# EAGLE design 国技館マトリクスLED (EAGLE 9.6.2)
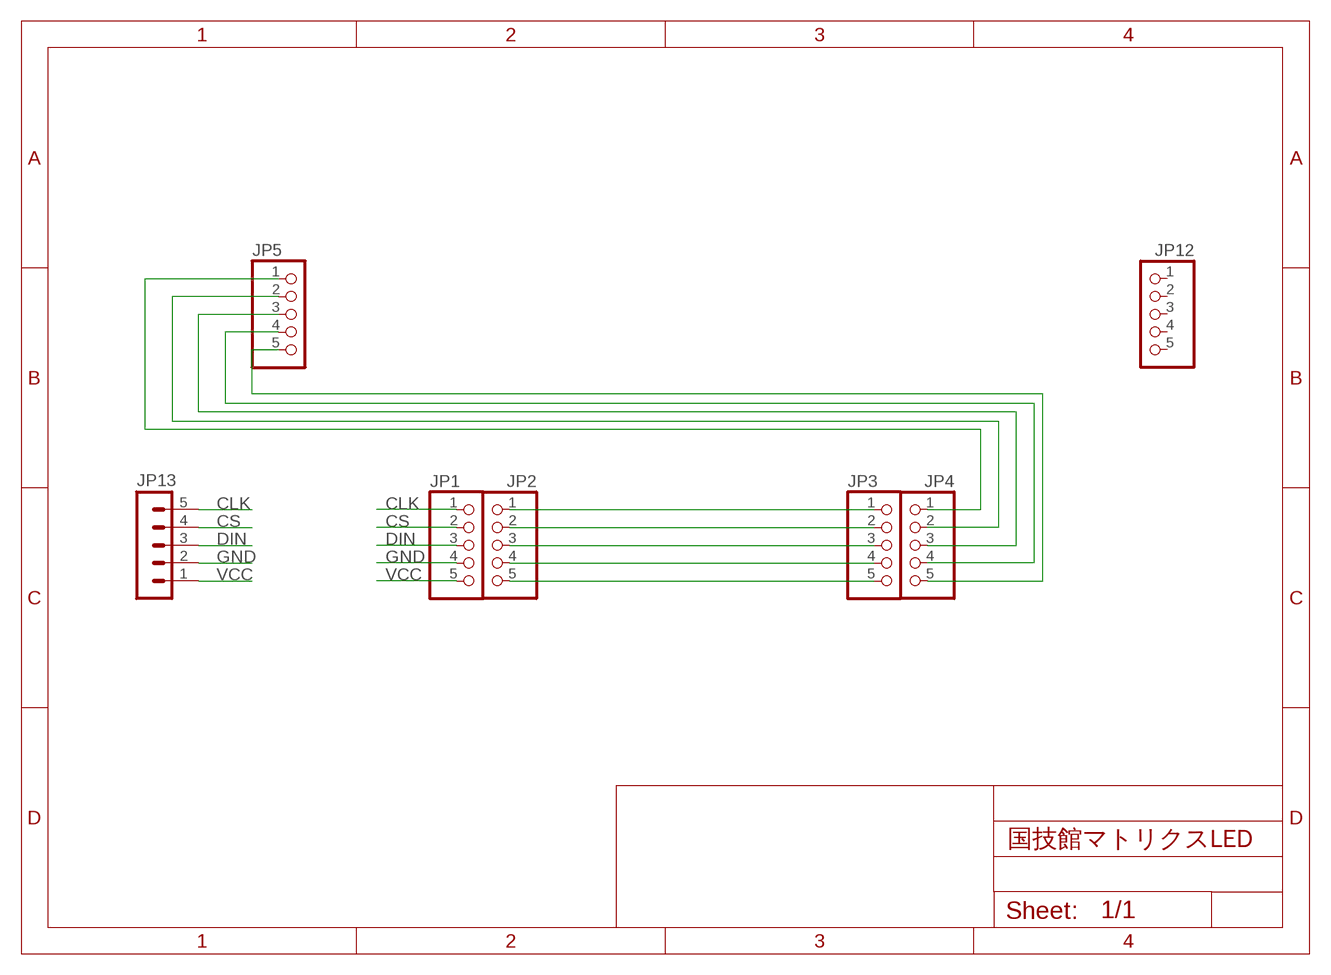
[diagram p0: schematic, sheet 1]

## Parts
JP1  PINHD-1X5  [1X05]
JP2  PINHD-1X5  [1X05]
JP3  PINHD-1X5  [1X05]
JP4  PINHD-1X5  [1X05]
JP5  PINHD-1X5  [1X05]
JP12  PINHD-1X5  [1X05]
JP13  05-JST  [B5B-XH]

## Nets
CLK: JP1.1 JP13.5
CS: JP1.2 JP13.4
DIN: JP1.3 JP13.3
GND: JP1.4 JP13.2
N$1: JP2.1 JP3.1
N$2: JP2.2 JP3.2
N$3: JP2.3 JP3.3
N$4: JP2.4 JP3.4
N$5: JP2.5 JP3.5
N$6: JP4.1 JP5.1
N$7: JP4.2 JP5.2
N$8: JP4.3 JP5.3
N$9: JP4.4 JP5.4
N$10: JP4.5 JP5.5
VCC: JP1.5 JP13.1
Unconnected: JP12.1 JP12.2 JP12.3 JP12.4 JP12.5

## Library data of the parts
JP1-JP5 JP12 = pinhead:PINHD-1X5: PIN HEADER
JP13 = con-jst-xh:05-JST: JST CONNECTOR

## Board
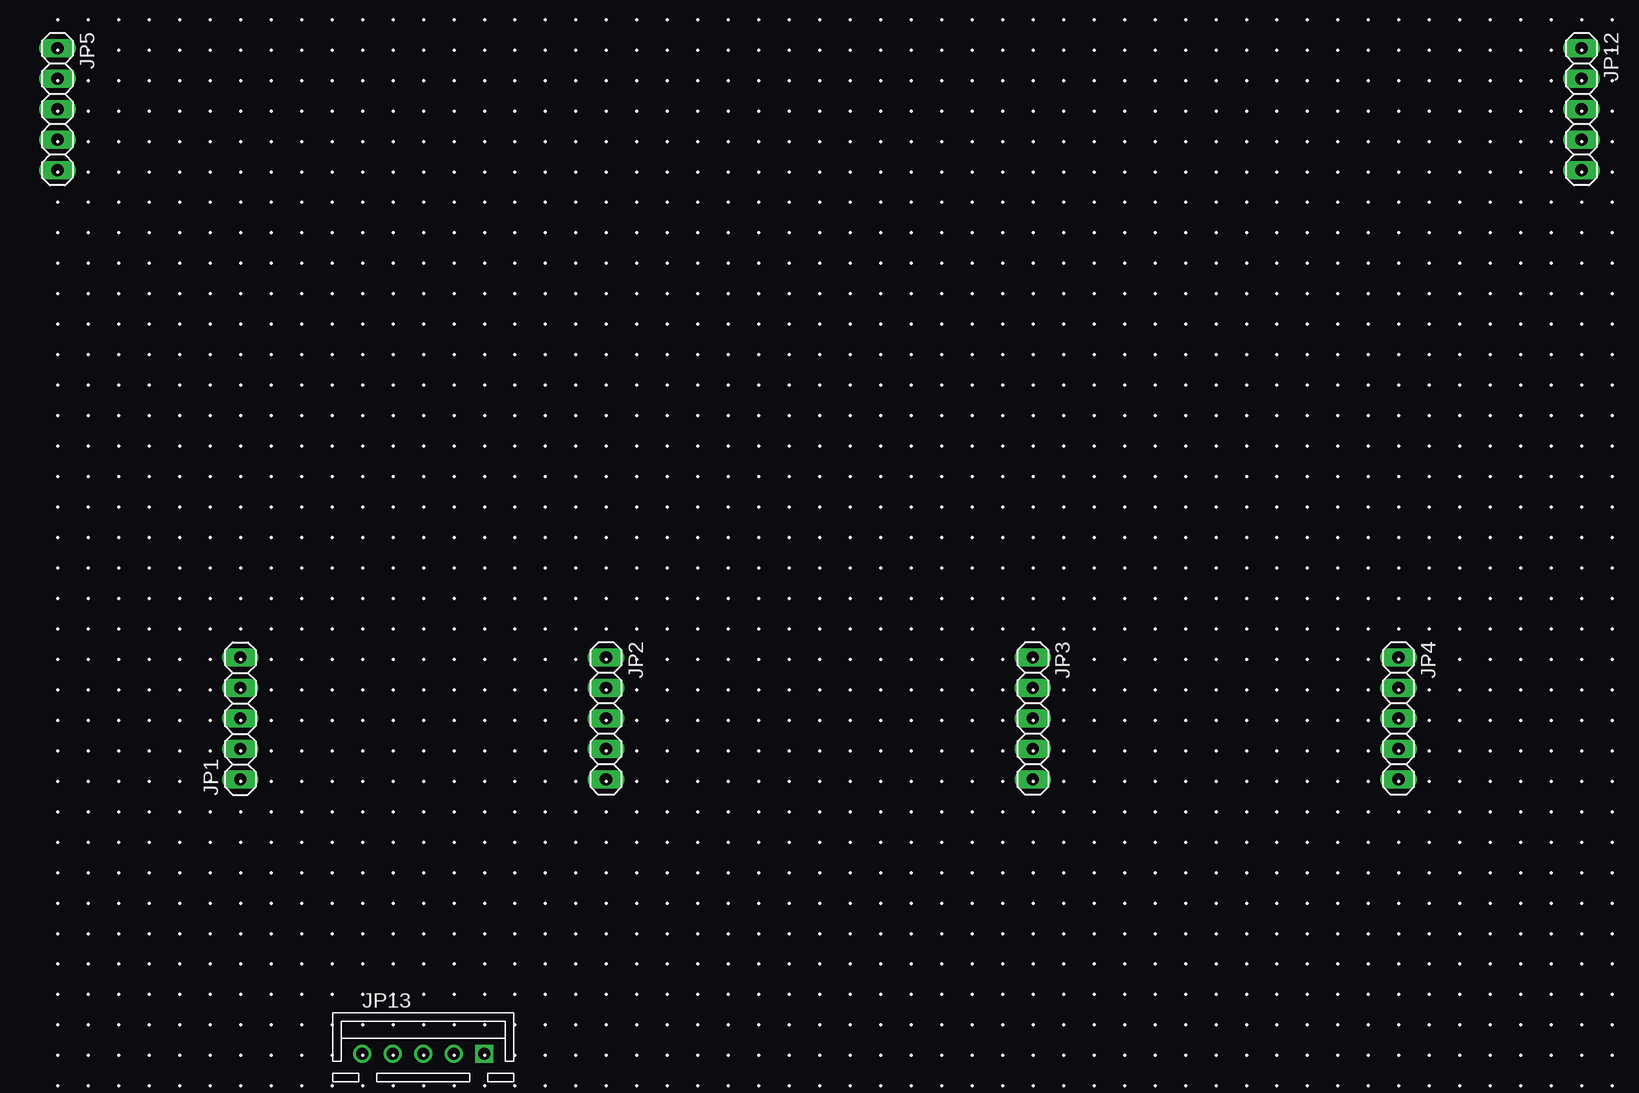
[diagram p1: board, top side]
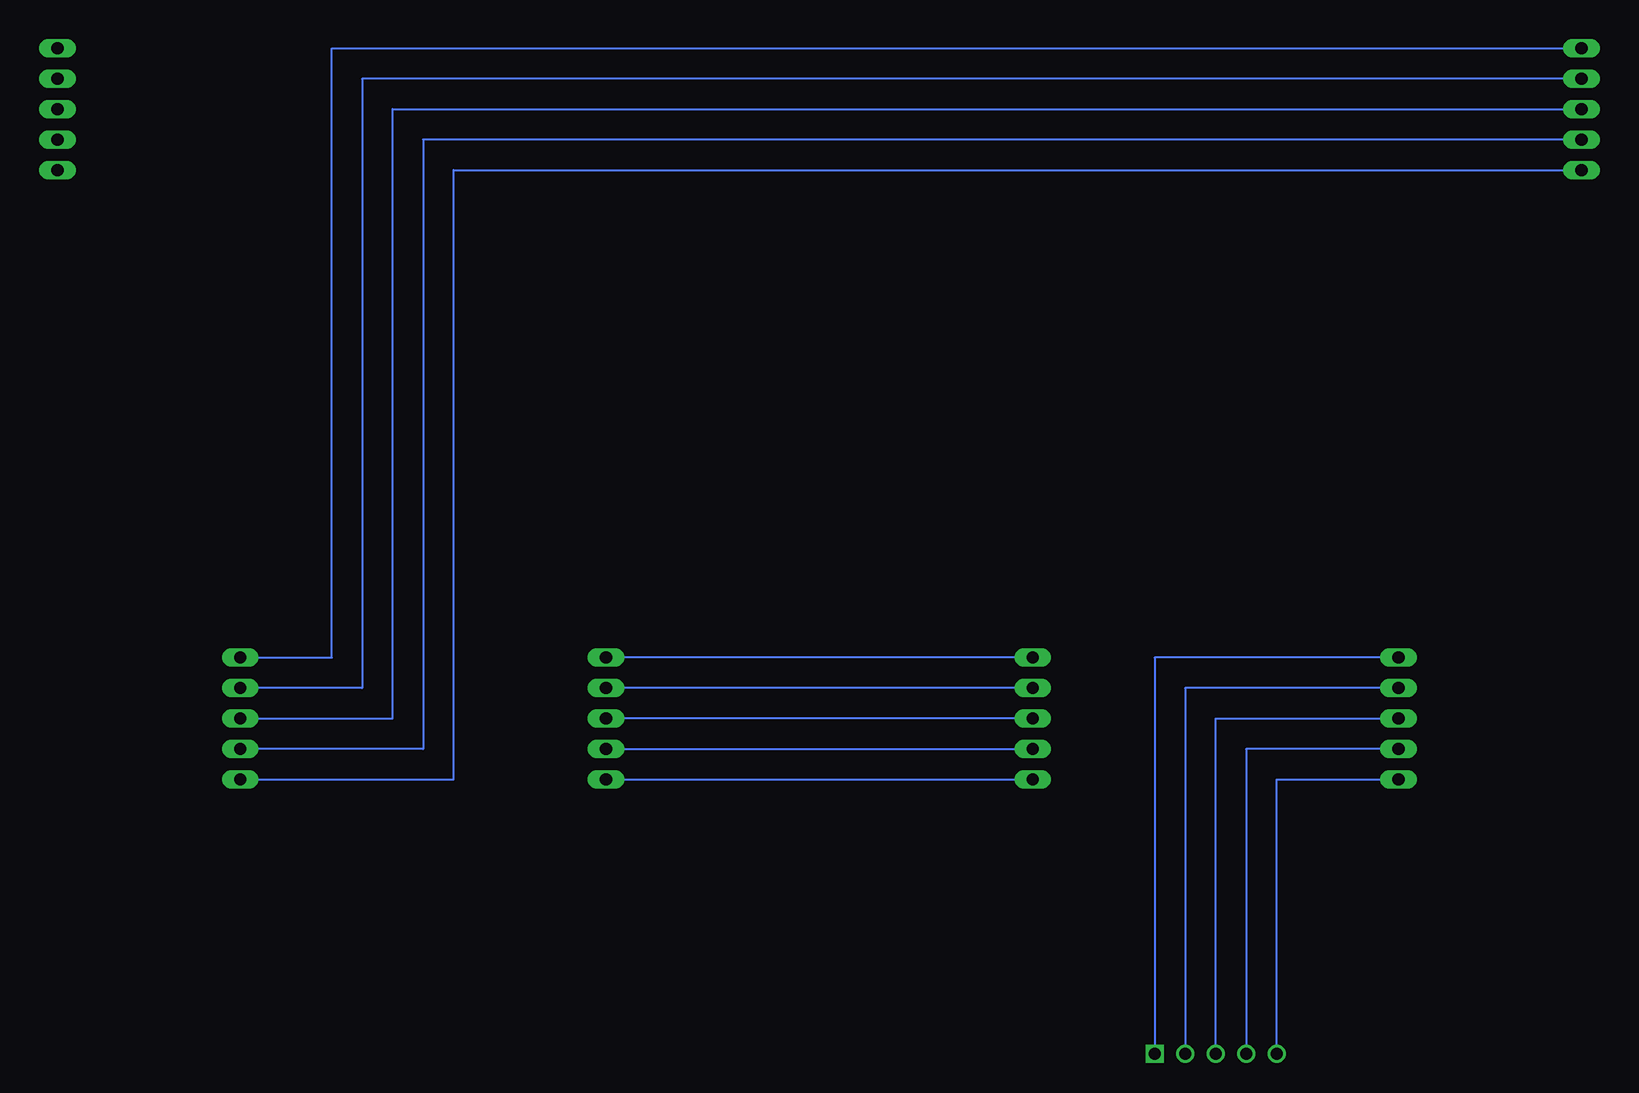
[diagram p2: board, bottom side, seen from below]

No outline drawn. Coordinates in mm, seen from the top.
Copper layers (1*16): Top 0.035mm / dielectric 1.5mm / Bottom 0.035mm
Design rules "default": minimum track width 6mil, minimum drill 0.35mm, track to track 6mil, track to pad 6mil, pad to pad 6mil, via to via 6mil, smd to smd 6mil, copper to edge 40mil, drill to drill 6mil, minimum pad ring 10mil, minimum via ring 8mil, stop-mask expansion 4mil, vias tented up to drill 0mil, thermal gap 10mil

### Footprints (pad centres in the part's own frame; a part is rotated, then mirrored left to right if it is on the bottom)
1X05 = drill 1.016 long: 1 -5.08,0; 2 -2.54,0; 3 0,0; 4 2.54,0; 5 5.08,0
B5B-XH = drill 1 square: 1 5.08,0 | drill 1: 2 2.54,0; 3 0,0; 4 -2.54,0; 5 -5.08,0

### Placement (x,y rotation side)
JP1  24.13,40.64 90 top
JP2  54.61,40.64 270 top
JP3  90.17,40.64 270 top
JP4  120.65,40.64 270 top
JP5  8.89,91.44 270 top
JP12  135.89,91.44 270 top
JP13  39.37,12.7 0 top
U$1  [TYPE.A]  0,0 0 top

### Tracks (layer width: path | path; a pad name or v marks a point on that pad's centre or on a via)
CLK
  Bottom 0.152: JP13.5 34.29,35.56 JP1.1
CS
  Bottom 0.152: JP1.2 36.83,38.1 JP13.4
DIN
  Bottom 0.152: JP13.3 39.37,40.64 JP1.3
GND
  Bottom 0.152: JP1.4 41.91,43.18 JP13.2
N$1
  Bottom 0.152: JP2.1 JP3.1
N$2
  Bottom 0.152: JP2.2 JP3.2
N$3
  Bottom 0.152: JP2.3 JP3.3
N$4
  Bottom 0.152: JP3.4 JP2.4
N$5
  Bottom 0.152: JP3.5 JP2.5
N$6
  Bottom 0.152: JP4.1 113.03,45.72 113.03,96.52 JP5.1
N$7
  Bottom 0.152: JP5.2 110.49,93.98 110.49,43.18 JP4.2
N$8
  Bottom 0.152: JP4.3 107.95,40.64 107.95,91.44 JP5.3
N$9
  Bottom 0.152: JP5.4 105.41,88.9 105.41,38.1 JP4.4
N$10
  Bottom 0.152: JP4.5 102.87,35.56 102.87,86.36 JP5.5
VCC
  Bottom 0.152: JP1.5 44.45,45.72 JP13.1